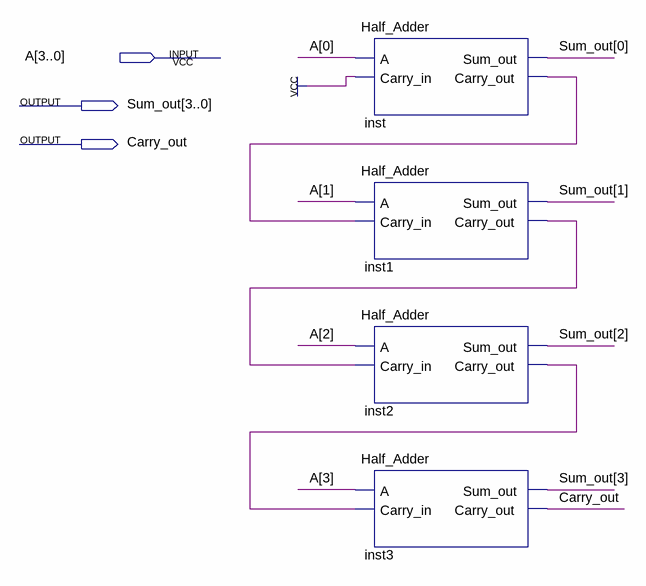
[diagram p0: schematic sheet]
// Quartus schematic Increment_Operation.bdf as structural Verilog: 4 symbols, 3 pins
module Increment_Operation (
  input  [3:0] A,
  output [3:0] Sum_out,
  output Carry_out
);

  wire inst1_carry_out, inst2_carry_out, inst_carry_out;

  Half_Adder inst (.A(A[0]), .Carry_in(1'b1), .Sum_out(Sum_out[0]), .Carry_out(inst_carry_out));
  Half_Adder inst1 (.A(A[1]), .Carry_in(inst_carry_out), .Sum_out(Sum_out[1]), .Carry_out(inst1_carry_out));
  Half_Adder inst2 (.A(A[2]), .Carry_in(inst1_carry_out), .Sum_out(Sum_out[2]), .Carry_out(inst2_carry_out));
  Half_Adder inst3 (.A(A[3]), .Carry_in(inst2_carry_out), .Sum_out(Sum_out[3]), .Carry_out(Carry_out));
endmodule
